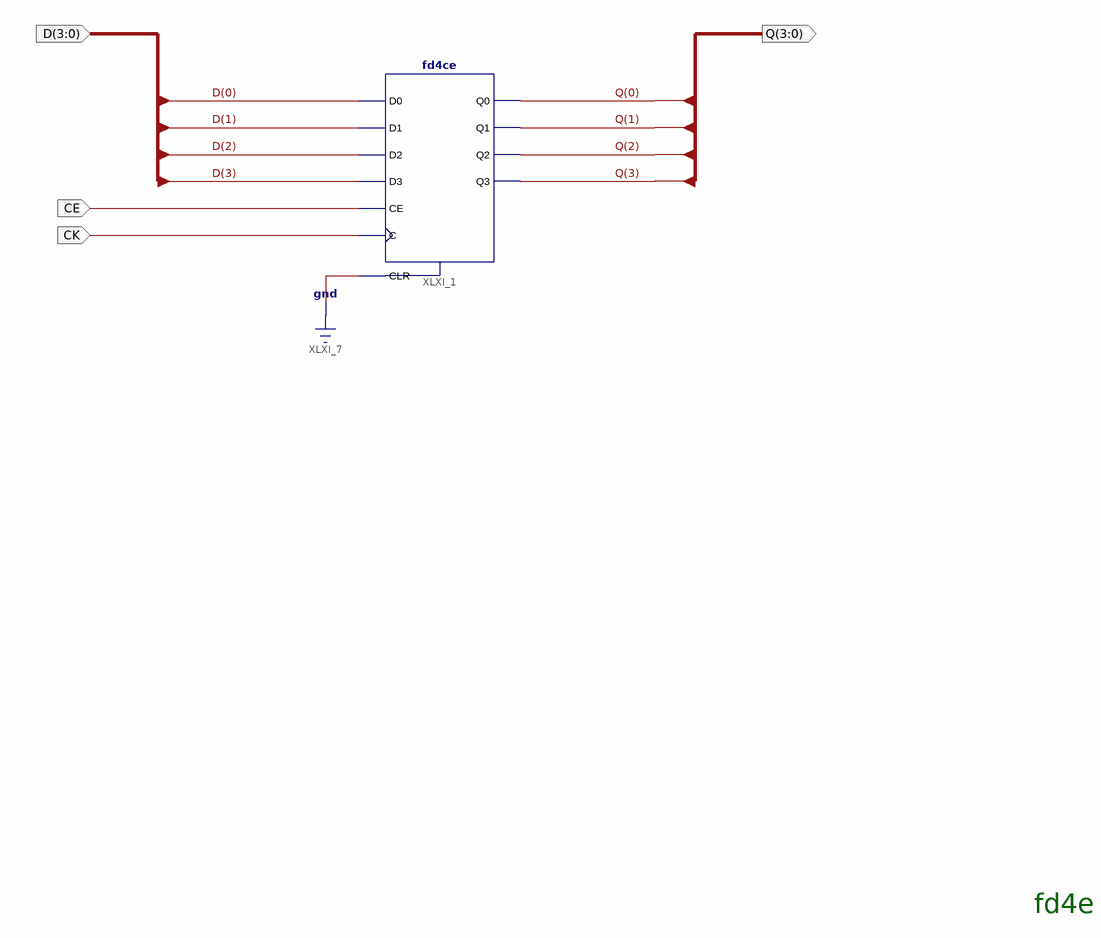
[diagram p0: schematic sheet 1]
// Xilinx ISE schematic fd4e.sch (virtex2p) as structural Verilog: 1 symbols, 4 ports
module fd4e (
  input  [3:0] D,
  input  CK,
  input  CE,
  output [3:0] Q
);

  fd4ce XLXI_1 (
    .C(CK), .CE(CE), .CLR(1'b0), .D0(D[0]), .D1(D[1]), .D2(D[2]), .D3(D[3]), .Q0(Q[0]), .Q1(Q[1]), .Q2(Q[2]),
    .Q3(Q[3]));

  // Notes on the sheet:
  //   fd4e
endmodule
